# Altium project Shawn_CurrentGetter.PrjPcb
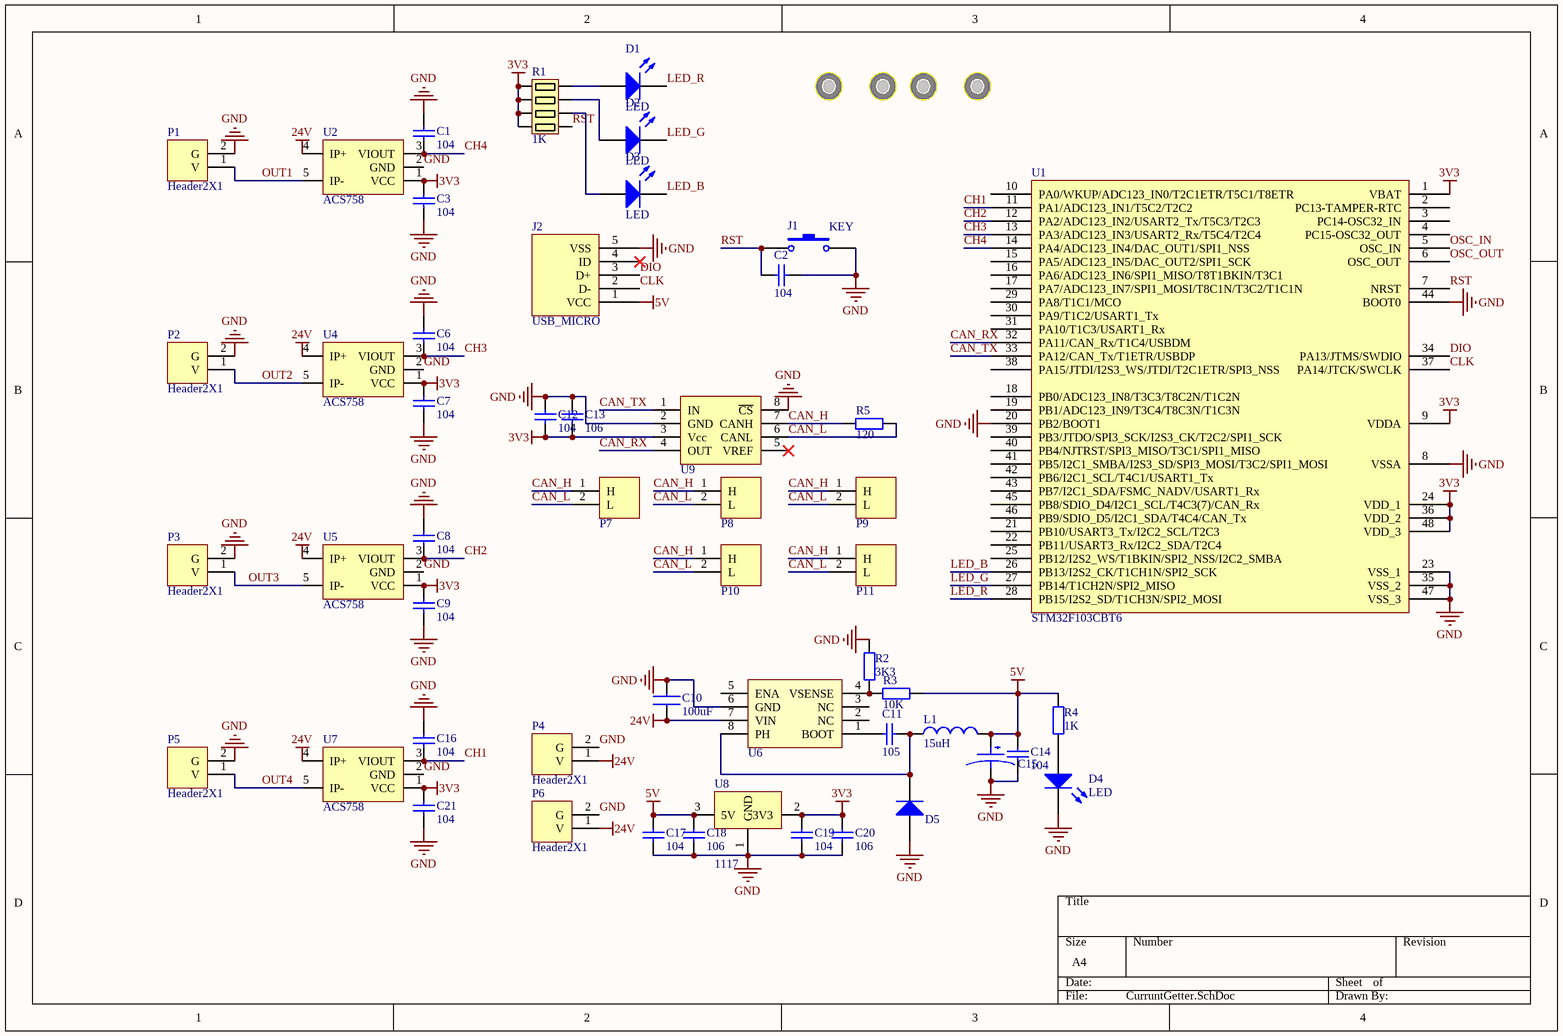
[diagram p0: CurruntGetter.SchDoc]
1 sheet, 55 parts. Net scope: global (net labels, ports and power ports of the same name join across sheets).
Board file: CurruntGetter.PcbDoc

## Sheet CurruntGetter.SchDoc
size A4

### Parts
1  Via_M3  [Via_M3]  (value not drawn)
2  Via_M3  [Via_M3]  (value not drawn)
3  Via_M3  [Via_M3]  (value not drawn)
4  Via_M3  [Via_M3]  (value not drawn)
C1  104  [0603C]
C2  104  [0603C]
C3  104  [0603C]
C6  104  [0603C]
C7  104  [0603C]
C8  104  [0603C]
C9  104  [0603C]
C10  100uF  [1201C]
C11  105  [0603C]
C12  104  [0603C]
C13  106  [0603C]
C14  104  [0603C]
C15  CAP_钽220  [cap_钽E封装]  (value not drawn)
C16  104  [0603C]
C17  104  [0603C]
C18  106  [0603C]
C19  104  [0603C]
C20  106  [0603C]
C21  104  [0603C]
D1  LED  [LED_0603]
D2  LED  [LED_0603]
D3  LED  [LED_0603]
D4  LED  [LED_0603]
D5  Diode_SS34  [Diode_SS34]  (value not drawn)
J1  KEY  [KEY]
J2  USB_MICRO  [USB_MICRO]
L1  15uH  [Inductor7.2X7.2]
P1  Header2X1  [Header_POWER]
P2  Header2X1  [Header_POWER]
P3  Header2X1  [Header_POWER]
P4  Header2X1  [Header_POWER]
P5  Header2X1  [Header_POWER]
P6  Header2X1  [Header_POWER]
P7  Header_CAN  [Header2_3002]  (value not drawn)
P8  Header_CAN  [Header2_3002]  (value not drawn)
P9  Header_CAN  [Header2_3002]  (value not drawn)
P10  Header_CAN  [Header2_3002]  (value not drawn)
P11  Header_CAN  [Header2_3002]  (value not drawn)
R1  1K  [8P4R_0603]
R2  3K3  [0603R]
R3  10K  [0603R]
R4  1K  [0603R]
R5  120  [0603R]
U1  STM32F103CBT6  [LQFP_48]
U2  ACS758  [PFF]
U4  ACS758  [PFF]
U5  ACS758  [PFF]
U6  TPS5430/5450  [TPS5430]  (value not drawn)
U7  ACS758  [PFF]
U8  1117  [SOT-223]
U9  VD230  [SO_8]  (value not drawn)

### Nets
3V3: C3.2 C7.2 C9.2 C12.1 C13.1 C19.2 C20.2 C21.2 R1.1 R1.2 R1.3 R1.4 U1.1(VBAT) U1.9(VDDA) U1.24(VDD_1) U1.36(VDD_2) U1.48(VDD_3) U2.1(VCC) U4.1(VCC) U5.1(VCC) U7.1(VCC) U8.2(3V3) U9.3(Vcc)
5V: C14.2 C15.2 C17.2 C18.2 J2.1(VCC) L1.2 R3.1 R4.2 U8.3(5V)
24V: C10.1 P4.1(V) P6.1(V) U2.4(IP+) U4.4(IP+) U5.4(IP+) U6.7(VIN) U7.4(IP+)
GND: C1.2 C2.2 C3.1 C6.2 C7.1 C8.2 C9.1 C10.2 C12.2 C13.2 C14.1 C15.1 C16.2 C17.1 C18.1 C19.1 C20.1 C21.1 D4.2(K) D5.1(A) J1.2 J2.5(VSS) P1.2(G) P2.2(G) P3.2(G) P4.2(G) P5.2(G) P6.2(G) R2.2 U1.8(VSSA) U1.20(PB2/BOOT1) U1.23(VSS_1) U1.35(VSS_2) U1.44(BOOT0) U1.47(VSS_3) U2.2(GND) U4.2(GND) U5.2(GND) U6.6(GND) U7.2(GND) U8.1(GND) U9.2(GND) U9.8(~{CS})
CAN_H: P7.1(H) P8.1(H) P9.1(H) P10.1(H) P11.1(H) R5.2 U9.7(CANH)
CAN_L: P7.2(L) P8.2(L) P9.2(L) P10.2(L) P11.2(L) R5.1 U9.6(CANL)
CAN_RX: U1.32(PA11/CAN_Rx/T1C4/USBDM) U9.4(OUT)
CAN_TX: U1.33(PA12/CAN_Tx/T1ETR/USBDP) U9.1(IN)
CH1: C16.1 U1.11(PA1/ADC123_IN1/T5C2/T2C2) U7.3(VIOUT)
CH2: C8.1 U1.12(PA2/ADC123_IN2/USART2_Tx/T5C3/T2C3) U5.3(VIOUT)
CH3: C6.1 U1.13(PA3/ADC123_IN3/USART2_Rx/T5C4/T2C4) U4.3(VIOUT)
CH4: C1.1 U1.14(PA4/ADC123_IN4/DAC_OUT1/SPI1_NSS) U2.3(VIOUT)
CLK: J2.2(D-) U1.37(PA14/JTCK/SWCLK)
DIO: J2.3(D+) U1.34(PA13/JTMS/SWDIO)
LED_B: D3.2(K) U1.26(PB13/I2S2_CK/T1CH1N/SPI2_SCK)
LED_G: D2.2(K) U1.27(PB14/T1CH2N/SPI2_MISO)
LED_R: D1.2(K) U1.28(PB15/I2S2_SD/T1CH3N/SPI2_MOSI)
OSC_IN: U1.5(OSC_IN)
OSC_OUT: U1.6(OSC_OUT)
OUT1: P1.1(V) U2.5(IP-)
OUT2: P2.1(V) U4.5(IP-)
OUT3: P3.1(V) U5.5(IP-)
OUT4: P5.1(V) U7.5(IP-)
RST: C2.1 J1.1 R1.5 U1.7(NRST)
NetC11_1: C11.1 U6.1(BOOT)
NetC11_2: C11.2 D5.2(K) L1.1 U6.8(PH)
NetD1_1: D1.1(A) R1.8
NetD2_1: D2.1(A) R1.7
NetD3_1: D3.1(A) R1.6
NetD4_1: D4.1(A) R4.1
NetR2_1: R2.1 R3.2 U6.4(VSENSE)

Not connected (* = marked no-connect by the designer): J2 4(ID)*; U1 2(PC13-TAMPER-RTC) 3(PC14-OSC32_IN) 4(PC15-OSC32_OUT) 10(PA0/WKUP/ADC123_IN0/T2C1ETR/T5C1/T8ETR) 15(PA5/ADC123_IN5/DAC_OUT2/SPI1_SCK) 16(PA6/ADC123_IN6/SPI1_MISO/T8T1BKIN/T3C1) 17(PA7/ADC123_IN7/SPI1_MOSI/T8C1N/T3C2/T1C1N) 18(PB0/ADC123_IN8/T3C3/T8C2N/T1C2N) 19(PB1/ADC123_IN9/T3C4/T8C3N/T1C3N) 21(PB10/USART3_Tx/I2C2_SCL/T2C3) 22(PB11/USART3_Rx/I2C2_SDA/T2C4) 25(PB12/I2S2_WS/T1BKIN/SPI2_NSS/I2C2_SMBA) 29(PA8/T1C1/MCO) 30(PA9/T1C2/USART1_Tx) 31(PA10/T1C3/USART1_Rx) 38(PA15/JTDI/I2S3_WS/JTDI/T2C1ETR/SPI3_NSS) 39(PB3/JTDO/SPI3_SCK/I2S3_CK/T2C2/SPI1_SCK) 40(PB4/NJTRST/SPI3_MISO/T3C1/SPI1_MISO) 41(PB5/I2C1_SMBA/I2S3_SD/SPI3_MOSI/T3C2/SPI1_MOSI) 42(PB6/I2C1_SCL/T4C1/USART1_Tx) 43(PB7/I2C1_SDA/FSMC_NADV/USART1_Rx) 45(PB8/SDIO_D4/I2C1_SCL/T4C3(7)/CAN_Rx) 46(PB9/SDIO_D5/I2C1_SDA/T4C4/CAN_Tx); U6 2(NC) 3(NC) 5(ENA); U9 5(VREF)*

### Library data of the parts
C1-C3 C6-C9 C11 C12 C14 C16 C17 C19 C21 = C_104: 0603/0805
  C1-C3 C6-C9 C12 C14 C16 C17 C19 C21: Value: 104
  C11: Value: 105
C10 = CAP100uF: Value: 100uF
C13 C18 C20 = C_106: 0603/0805; Value: 106
C15 = CAP_钽220: CAP
D5 = Diode_SS34: 肖特基二极管
L1 = Inductor: 屏蔽电感
P1-P6 = Header2X1: power
R1 = R_8P4R: value: 1k
R2-R5 = R: 0603/0805
  R2: Value: 3K3
  R3: Value: 10K
  R4: Value: 1k
  R5: Value: 120
U1 = STM32F103CBT6: 48
U6 = TPS5430/5450: 降压
U8 = AMS1117-3.3
U9 = VD230: SO-8